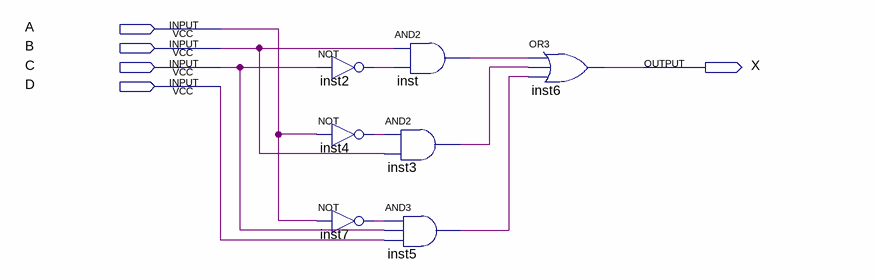
[diagram p0: schematic sheet]
// Quartus schematic circuito_logico.bdf as structural Verilog: 7 symbols, 5 pins
module circuito_logico (
  input  A,
  input  B,
  input  C,
  input  D,
  output X
);

  wire inst2_out, inst3_out, inst4_out, inst5_out, inst7_out, inst_out;

  not inst2 (inst2_out, C);
  not inst4 (inst4_out, A);
  not inst7 (inst7_out, A);
  and inst (inst_out, B, inst2_out);
  and inst3 (inst3_out, inst4_out, B);
  and inst5 (inst5_out, inst7_out, C, D);
  or inst6 (X, inst_out, inst3_out, inst5_out);
endmodule
